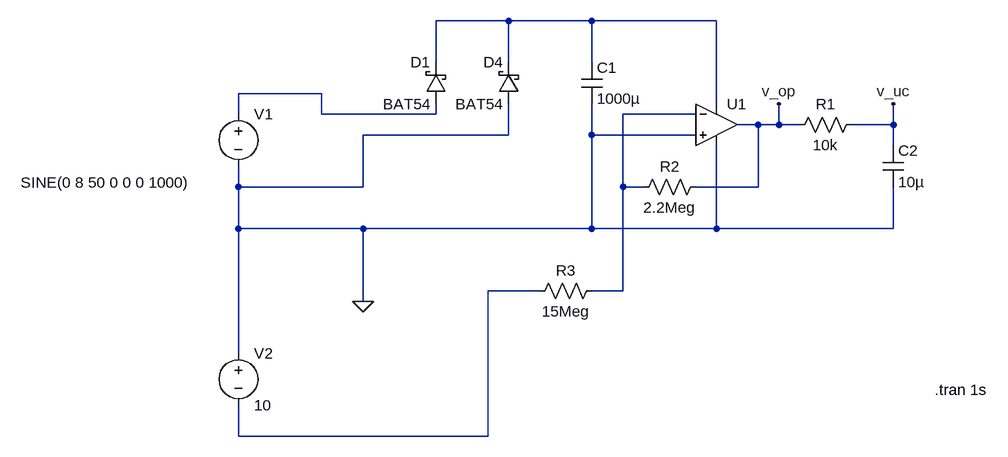
[diagram p0: schematic opamp-rect-single.asc]
opamp-rect-single.asc, the LTspice schematic file:
Version 4
SHEET 1 1004 680
WIRE 256 -144 144 -144
WIRE 384 -144 256 -144
WIRE 576 -144 384 -144
WIRE 144 -80 144 -144
WIRE 256 -80 256 -144
WIRE 384 -80 384 -144
WIRE -32 -32 -160 -32
WIRE 576 -16 576 -144
WIRE -160 0 -160 -32
WIRE -32 0 -32 -32
WIRE 144 0 144 -16
WIRE 144 0 -32 0
WIRE 544 0 432 0
WIRE 640 16 608 16
WIRE 672 16 672 -16
WIRE 672 16 640 16
WIRE 704 16 672 16
WIRE 848 16 848 -16
WIRE 848 16 784 16
WIRE 256 32 256 -16
WIRE 256 32 32 32
WIRE 384 32 384 -16
WIRE 544 32 384 32
WIRE 848 48 848 16
WIRE -160 112 -160 80
WIRE 32 112 32 32
WIRE 32 112 -160 112
WIRE 432 112 432 0
WIRE 464 112 432 112
WIRE 640 112 640 16
WIRE 640 112 544 112
WIRE -160 176 -160 112
WIRE 32 176 -160 176
WIRE 384 176 384 32
WIRE 384 176 32 176
WIRE 576 176 576 48
WIRE 576 176 384 176
WIRE 848 176 848 112
WIRE 848 176 576 176
WIRE 304 272 224 272
WIRE 432 272 432 112
WIRE 432 272 384 272
WIRE 32 288 32 176
WIRE -160 368 -160 176
WIRE -160 496 -160 448
WIRE 224 496 224 272
WIRE 224 496 -160 496
FLAG 32 288 0
FLAG 672 -16 v_op
FLAG 848 -16 v_uc
SYMBOL voltage -160 -16 R0
WINDOW 3 -335 121 Left 2
WINDOW 123 0 0 Left 0
WINDOW 39 0 0 Left 0
SYMATTR Value SINE(0 8 50 0 0 0 1000)
SYMATTR InstName V1
SYMBOL voltage -160 352 R0
WINDOW 123 0 0 Left 0
WINDOW 39 0 0 Left 0
SYMATTR InstName V2
SYMATTR Value 10
SYMBOL schottky 160 -16 R180
WINDOW 0 24 64 Left 2
WINDOW 3 24 0 Left 2
SYMATTR InstName D1
SYMATTR Value BAT54
SYMATTR Description Diode
SYMATTR Type diode
SYMBOL schottky 272 -16 R180
WINDOW 0 24 64 Left 2
WINDOW 3 24 0 Left 2
SYMATTR InstName D4
SYMATTR Value BAT54
SYMATTR Description Diode
SYMATTR Type diode
SYMBOL Opamps\\UniversalOpamp2 576 16 R0
SYMATTR InstName U1
SYMBOL cap 368 -80 R0
SYMATTR InstName C1
SYMATTR Value 1000µ
SYMBOL res 800 0 R90
WINDOW 0 0 56 VBottom 2
WINDOW 3 32 56 VTop 2
SYMATTR InstName R1
SYMATTR Value 10k
SYMBOL cap 832 48 R0
SYMATTR InstName C2
SYMATTR Value 10µ
SYMBOL res 560 96 R90
WINDOW 0 0 56 VBottom 2
WINDOW 3 32 56 VTop 2
SYMATTR InstName R2
SYMATTR Value 2.2Meg
SYMBOL res 400 256 R90
WINDOW 0 0 56 VBottom 2
WINDOW 3 32 56 VTop 2
SYMATTR InstName R3
SYMATTR Value 15Meg
TEXT 912 424 Left 2 !.tran 1s

The netlist it stands for:
* opamp-rect-single.asc
V1 N002 0 SINE(0 8 50 0 0 0 1000)
V2 0 N004 10
D1 N002 N001 BAT54
D4 0 N001 BAT54
XU1 0 N003 N001 0 v_op level.2 Avol=1Meg GBW=10Meg Slew=10Meg ilimit=25m rail=0 Vos=0 phimargin=45 en=0 enk=0 in=0 ink=0 Rin=500Meg  ; pins IN+ IN- V+ V- OUT
C1 N001 0 1000µ
R1 v_uc v_op 10k
C2 v_uc 0 10µ
R2 v_op N003 2.2Meg
R3 N003 N004 15Meg
.model D D
.lib standard.dio
.tran 1s
.lib UniversalOpamps2.sub
.backanno
.end